# EAGLE design Addon-mapleCUx_Raspi-3V3-UART-CC2530-V007 (EAGLE 7.6.0)
MAPLE-CUx Large Version
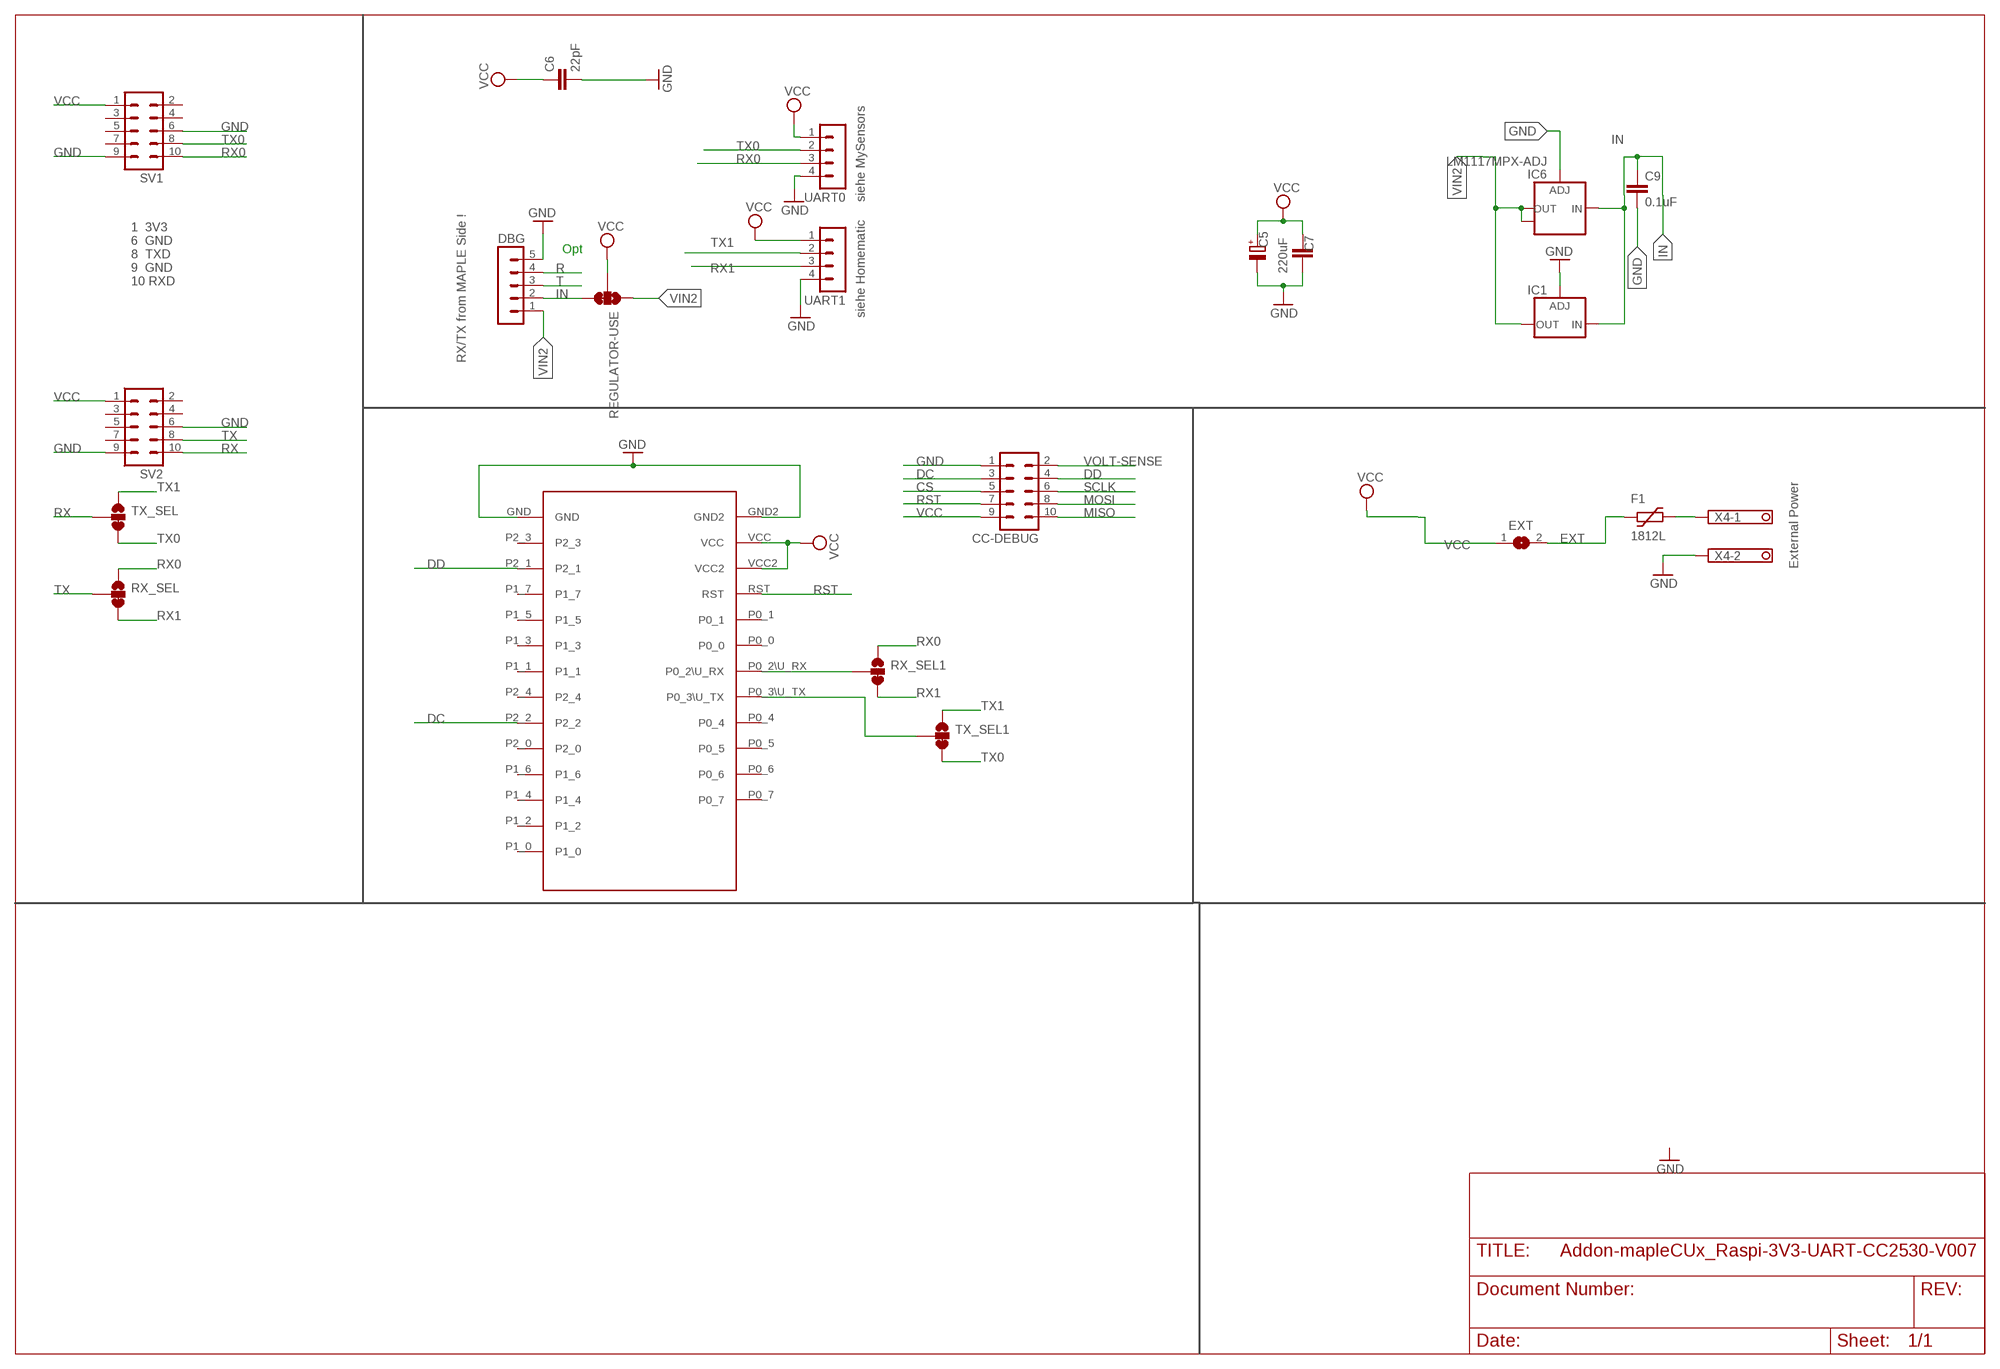
[diagram p0: schematic, sheet 1]

## Parts
C5  220uF  CPOL-EUE5-8.5  [E5-8,5]
C6  22pF  C-EUC0805  [C0805]
C7  C-EUC1812  [C1812]
C9  0.1uF  C-EUC1206  [C1206]
CC-DEBUG  MA05-2  [MA05-2]
DBG  MA05-1  [MA05-1]
EXT  SJ  [SJ]
F1  1812L  [1812L]
IC1  LD117ADT50TR  [DPACK]
IC6  LM1117MPX-ADJ  [SOT223]
REGULATOR-USE  JUMPER-SMT_3_1-NC_TRACE_SILK  [SMT-JUMPER_3_1-NC_TRACE_SILK]
RX_SEL  JUMPER-SMT_3_1-NC_TRACE_SILK  [SMT-JUMPER_3_1-NC_TRACE_SILK]
RX_SEL1  JUMPER-SMT_3_1-NC_TRACE_SILK  [SMT-JUMPER_3_1-NC_TRACE_SILK]
SV1  MA05-2  [MA05-2]
SV2  MA05-2  [MA05-2]
TX_SEL  JUMPER-SMT_3_1-NC_TRACE_SILK  [SMT-JUMPER_3_1-NC_TRACE_SILK]
TX_SEL1  JUMPER-SMT_3_1-NC_TRACE_SILK  [SMT-JUMPER_3_1-NC_TRACE_SILK]
U$3  CC2530_MODULE  [CC2530_DIL]
UART0  MA04-1  [MA04-1]
UART1  MA04-1  [MA04-1]
X4  1751248  [1751248]

## Nets
CS: CC-DEBUG.5
DC: CC-DEBUG.3 U$3.P2_2
DD: CC-DEBUG.4 U$3.P2_1
EXT [PWR]: EXT.2 F1.P$1
GND [PWR]: C5.- C6.2 C7.1 C9.2 CC-DEBUG.1 DBG.5 IC1.1(ADJ) IC6.1(ADJ) SV1.6 SV1.9 SV2.6 SV2.9 U$3.GND U$3.GND2 UART0.4 UART1.4 X4.2
IN [PWR]: C9.1 DBG.2 IC1.3(IN) IC6.3(IN) REGULATOR-USE.3
MISO: CC-DEBUG.10
MOSI: CC-DEBUG.8
N$2: RX_SEL1.2 U$3.P0_2\U_RX
N$3: TX_SEL1.2 U$3.P0_3\U_TX
N$45 [PWR]: F1.P$2 X4.1
R: DBG.4
RST: CC-DEBUG.7 U$3.RST
RX: SV2.10 TX_SEL.2
RX0: RX_SEL1.1 RX_SEL.1 SV1.10 UART0.3
RX1: RX_SEL1.3 RX_SEL.3 UART1.3
SCLK: CC-DEBUG.6
T: DBG.3
TX: RX_SEL.2 SV2.8
TX0: SV1.8 TX_SEL1.3 TX_SEL.3 UART0.2
TX1: TX_SEL1.1 TX_SEL.1 UART1.2
VCC [PWR]: C5.+ C6.1 C7.2 CC-DEBUG.9 EXT.1 REGULATOR-USE.2 SV1.1 SV2.1 U$3.VCC U$3.VCC2 UART0.1 UART1.1
VIN2 [PWR]: DBG.1 IC1.4(OUT) IC6.2(OUT) IC6.TAB(OUT1) REGULATOR-USE.1
VOLT-SENSE: CC-DEBUG.2
Unconnected: SV1.2 SV1.3 SV1.4 SV1.5 SV1.7 SV2.2 SV2.3 SV2.4 SV2.5 SV2.7 U$3.P0_0 U$3.P0_1 U$3.P0_4 U$3.P0_5 U$3.P0_6 U$3.P0_7 U$3.P1_0 U$3.P1_1 U$3.P1_2 U$3.P1_3 U$3.P1_4 U$3.P1_5 U$3.P1_6 U$3.P1_7 U$3.P2_0 U$3.P2_3 U$3.P2_4

## Notes on the sheet
- siehe MySensors
- Opt
- 1  3V3
  6  GND
  8  TXD
  9  GND
  10 RXD
- siehe Homematic
- RX/TX from MAPLE Side !
- External Power

## Library data of the parts
C5 = rcl:CPOL-EU: POLARIZED CAPACITOR, European symbol; SPICEPREFIX: C
C6 C7 C9 = rcl:C-EU: CAPACITOR, European symbol; SPICEPREFIX: C
CC-DEBUG SV1 SV2 = con-lstb:MA05-2: PIN HEADER; OC_FARNELL: unknown; OC_NEWARK: unknown
DBG = con-lstb:MA05-1: PIN HEADER; OC_FARNELL: unknown; OC_NEWARK: unknown
EXT = jumper:SJ: SMD solder JUMPER
F1 = ptc-littlefuse:1812L
IC1 = v-reg:LD117A?*: Low drop fixed and adjustable positive voltage regulators 1 A Source: http://www.st.com/stonline/products/literature/ds/7194/ld1117axx.pdf
IC6 = lm1117:LM1117MPX-ADJ
REGULATOR-USE RX_SEL RX_SEL1 TX_SEL TX_SEL1 = SparkFun-Jumpers:JUMPER-SMT_3_1-NC_TRACE: Normally closed trace jumper (1 of 2 connections) This jumper has a trace between two pads so it's normally closed (NC). The other connection is normally open (NO). Use a razor knife to open the connection. For best results follow the IPC guidelines for cutting traces: Cutout at least 0.063 mm (0.005 in). Remove all loose material to clean up the cut area. Seal the cut with an approved epoxy. Reapply solder to reclose the connection, or to close the NO connection.
U$3 = Martin-Communication-V3:CC2530_MODULE
UART0 UART1 = con-lstb:MA04-1: PIN HEADER; OC_FARNELL: unknown; OC_NEWARK: unknown
X4 = con-phoenix-350:1751248: MKDS 1/ 2-3,5 Printklemme Nennstrom: 10 A Bemessungsspannung: 160 V Raster: 3,5 mm Polzahl: 2 Montageart: Löten Anschlussart: Schraubanschluss Anschlussrichtung vom Leiter zur Platine: 0° Source: http://eshop.phoenixcontact.com .. 1751248.pdf; OC_FARNELL: unknown; OC_NEWARK: unknown

## Net classes
0 default: width 0.305 mm
1 PWR: width 0.914 mm

## Board
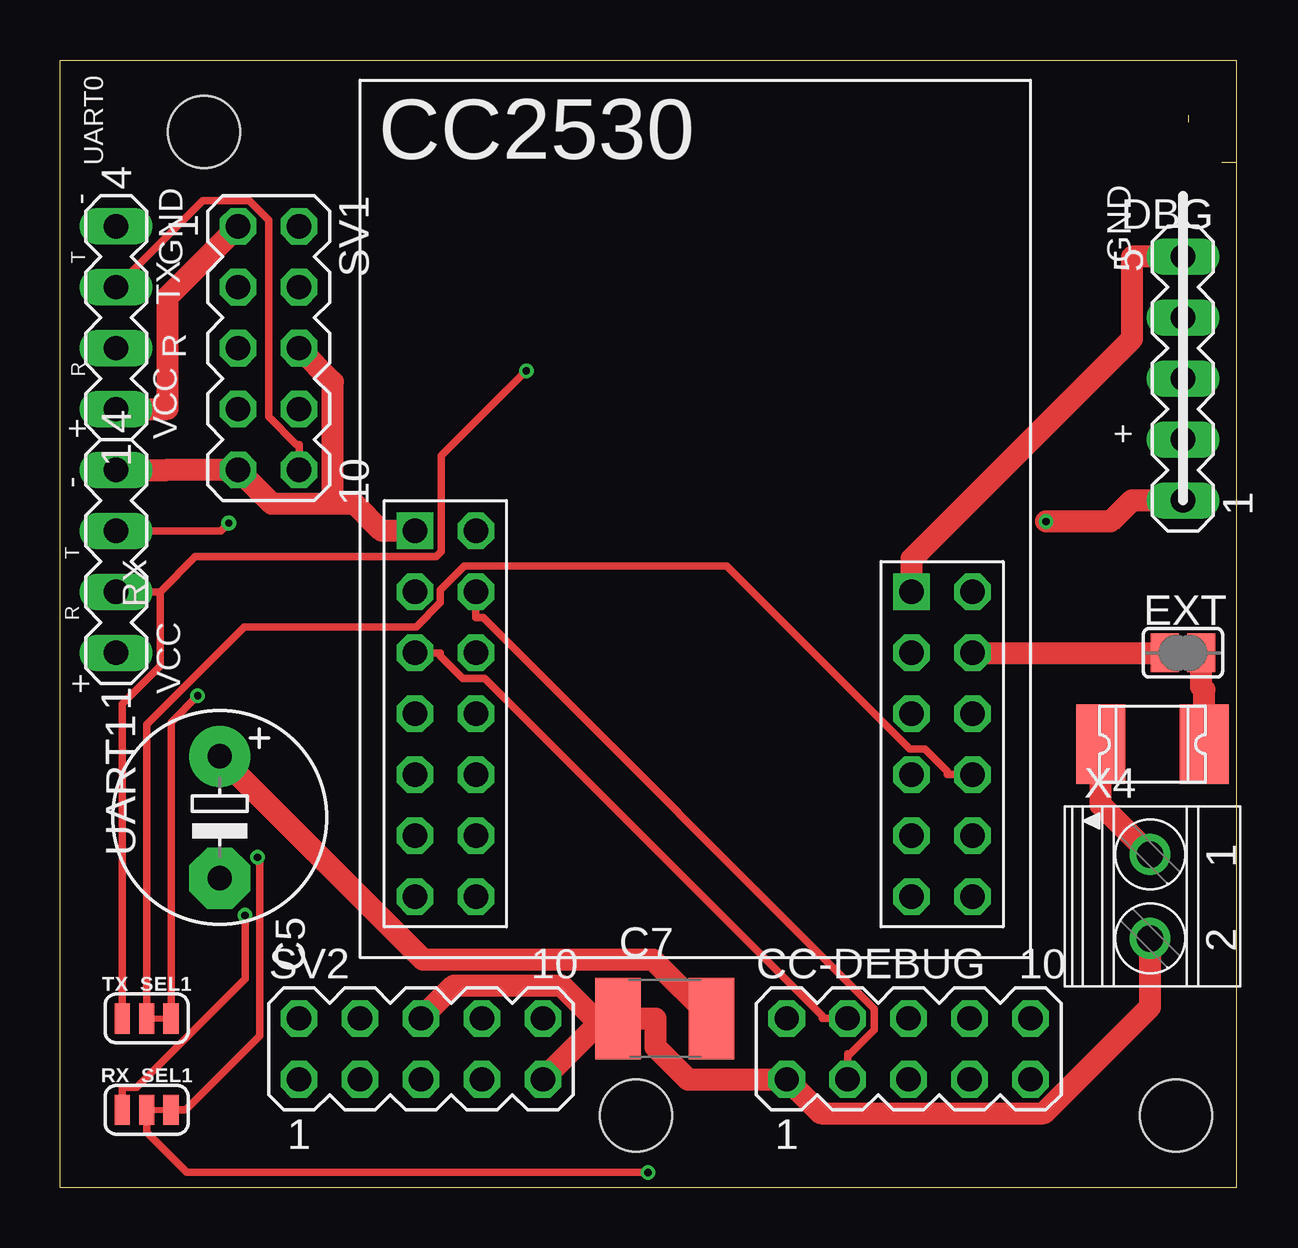
[diagram p1: board, top side]
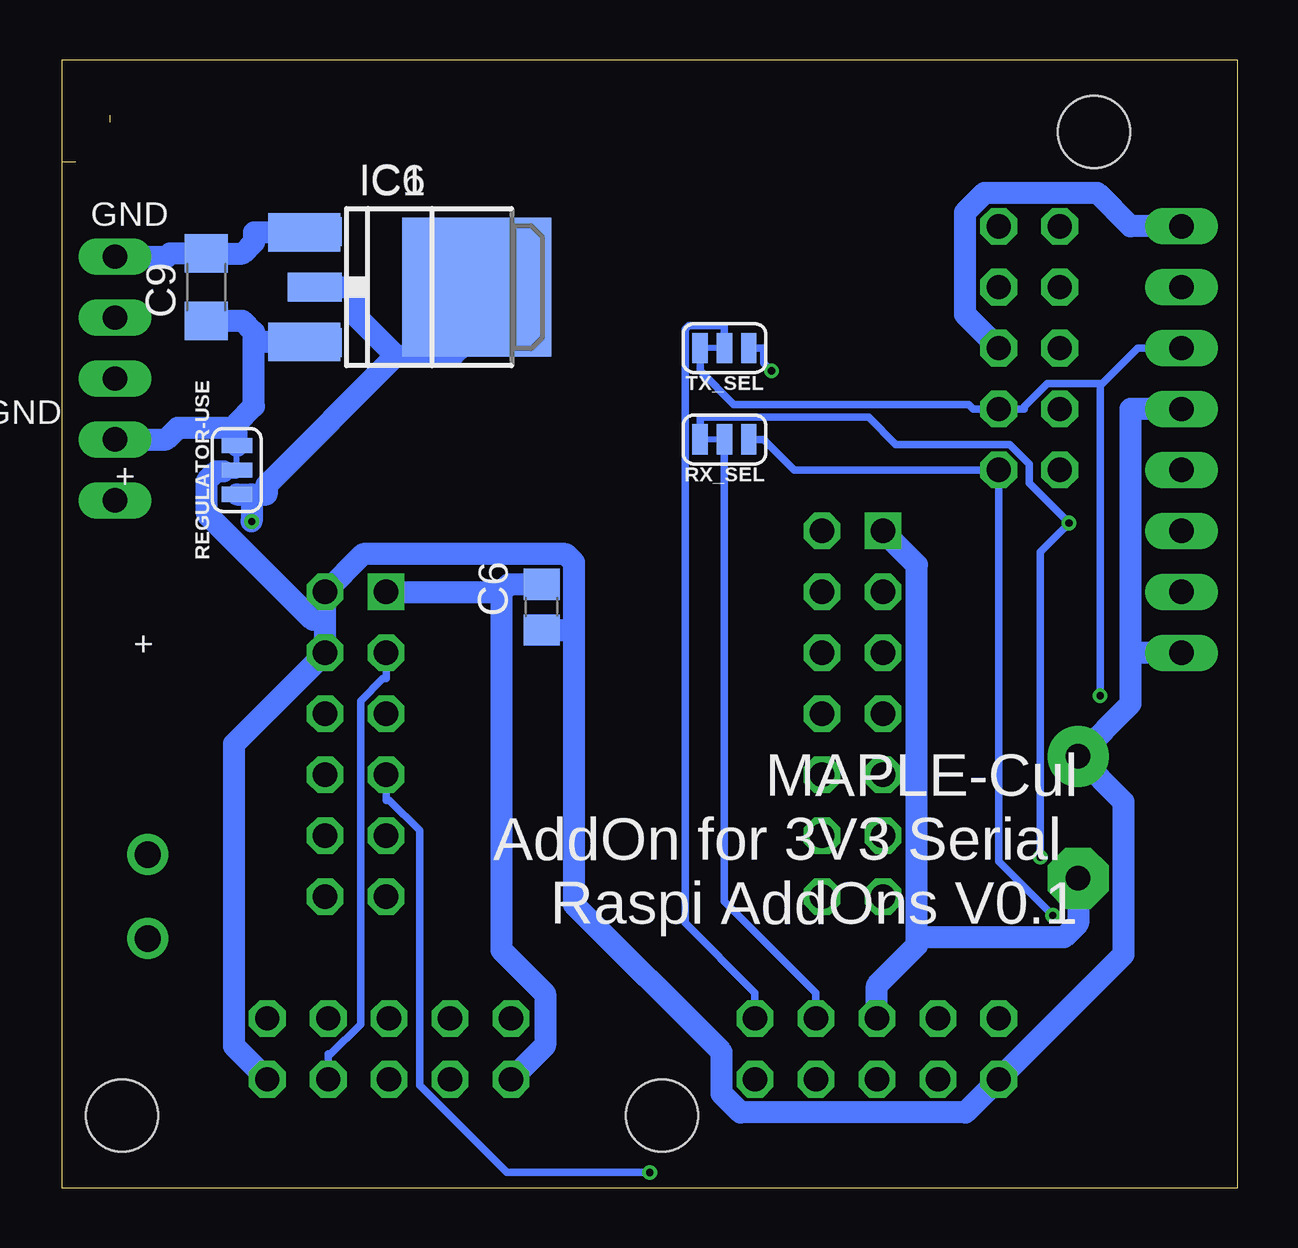
[diagram p2: board, bottom side, seen from below]

Size 49 x 47 mm. Coordinates in mm from the lower left corner, seen from the top.
Outline: 49,47 49,46.24
Outline: 47,44.7 47,44.41
Outline: 48.41,42.75 49,42.75
Outline: 49,47 0,47 0,0 49,0 49,42.75
Outline: 49,47 49,42.75
Copper layers (1*16): Top 0.035mm / dielectric 1.5mm / Bottom 0.035mm
Design rules "SeeedStudio_2layer_DRU_no_angle_20140221": minimum track width 6mil, minimum drill 12mil, track to track 6mil, track to pad 6mil, pad to pad 6mil, via to via 6mil, smd to smd 0mil, copper to edge 10mil, drill to drill 10mil, minimum pad ring 10mil, minimum via ring 6mil, stop-mask expansion 2mil, vias tented up to drill 100mil, thermal gap 10mil
Holes 3 mm at 6,44 24,3 46.5,3
tRestrict: area 0.4,2 to 1.1,47.1
bRestrict: area 0.4,0.7 to 1.1,46.4

### Footprints (pad centres in the part's own frame; a part is rotated, then mirrored left to right if it is on the bottom)
E5-8,5 = drill 1.016 pad 2.54: + -2.54,0 | drill 1.016 pad 2.54 octagon: - 2.54,0
C0805 = smd 1.3 x 1.5: 1 -0.95,0; 2 0.95,0
C1812 = smd 1.9 x 3.4: 1 -1.95,0; 2 1.95,0
C1206 = smd 1.6 x 1.8: 1 -1.4,0; 2 1.4,0
MA05-2 = drill 1.016 octagon: 1 -5.08,-1.27; 2 -5.08,1.27; 3 -2.54,-1.27; 4 -2.54,1.27; 5 0,-1.27; 6 0,1.27; 7 2.54,-1.27; 8 2.54,1.27; 9 5.08,-1.27; 10 5.08,1.27
MA05-1 = drill 1.016 long: 1 -5.08,0; 2 -2.54,0; 3 0,0; 4 2.54,0; 5 5.08,0
SJ = smd 1.168 x 1.6: 1 -0.762,0; 2 0.762,0
1812L = smd 2.03 x 3.3: P$1 -2.16,0; P$2 2.16,0
DPACK = smd 1.6 x 3: 1 -2.28,-4.8; 3 2.28,-4.8 | smd 5.8 x 6.2: 4 0,2.38
SOT223 = smd 1.219 x 2.235: 1 -2.311,-3.099; 2 0,-3.099; 3 2.311,-3.099 | smd 3.6 x 2.2: TAB 0,3.099
SMT-JUMPER_3_1-NC_TRACE_SILK = smd 0.635 x 1.27: 1 -1.016,0; 2 0,0; 3 1.016,0
CC2530_DIL = drill 1.016 square: GND -11.684,-1.27; GND2 9.017,-3.81 | drill 1.016 octagon: P0_0 9.017,-8.89; P0_1 11.557,-8.89; P0_2\U_RX 9.017,-11.43; P0_3\U_TX 11.557,-11.43; P0_4 9.017,-13.97; P0_5 11.557,-13.97; P0_6 9.017,-16.51; P0_7 11.557,-16.51; P1_0 -9.144,-16.51; P1_1 -11.684,-16.51; P1_2 -9.144,-13.97; P1_3 -11.684,-13.97; P1_4 -9.144,-11.43; P1_5 -11.684,-11.43; P1_6 -9.144,-8.89; P1_7 -11.684,-8.89; P2_0 -9.144,-6.35; P2_1 -11.684,-6.35; P2_2 -9.144,-3.81; P2_3 -11.684,-3.81; P2_4 -9.144,-1.27; RST 9.017,-6.35; VCC 11.557,-3.81; VCC2 11.557,-6.35
MA04-1 = drill 1.016 long: 1 -3.81,0; 2 -1.27,0; 3 1.27,0; 4 3.81,0
1751248 = drill 1.1 pad 1.7: 1 -1.75,-0.1; 2 1.75,-0.1

### Placement (x,y rotation side)
C5  6.66,15.43 270 top
C6  29.01,24.2 90 bottom
C7  25.2,7.05 0 top
C9  42.98,37.53 90 bottom
CC-DEBUG  35.36,5.78 0 top
DBG  46.79,33.72 90 top
EXT  46.79,22.29 0 top
F1  45.52,18.48 180 top
IC1  34.09,37.53 270 bottom
IC6  35.36,37.53 270 bottom
REGULATOR-USE  41.71,29.91 90 bottom
RX_SEL  21.39,31.18 180 bottom
RX_SEL1  3.61,3.24 0 top
SV1  8.69,34.99 270 top
SV2  15.04,5.78 0 top
TX_SEL  21.39,34.99 180 bottom
TX_SEL1  3.61,7.05 0 top
U$3  26.47,28.64 0 top
UART0  2.34,36.26 90 top
UART1  2.34,26.1 90 top
X4  45.52,12.13 270 top

### Tracks (layer width: path | path; a pad name or v marks a point on that pad's centre or on a via)
DC
  Top 0.305: CC-DEBUG.3 32.82,5.58 32.93,5.58 33.93,6.58 33.93,7.46 17.63,23.76 17.33,23.76 U$3.P2_2
DD
  Top 0.305: CC-DEBUG.4 31.75,7.05 31.75,7.16 17.69,21.22 16.79,21.22 15.85,22.16 15.85,22.29 U$3.P2_1
EXT
  Top 0.914: F1.P$1 47.68,20.74 47.55,20.87 EXT.2
GND
  Top 0.914: 22.27,7.05 22.27,6.66 SV2.9 | SV2.6 16.42,8.43 20.89,8.43 22.27,7.05 | 22.27,7.05 22.47,7.05 C7.1 24.81,7.05 24.81,5.86 26.16,4.51 CC-DEBUG.1 31.69,3.1 41,3.1 45.42,7.53 X4.2 | 11.37,28.49 11.37,33.58 SV1.6 | 11.37,28.49 12.29,28.49 13.41,27.37 U$3.GND | 11.37,28.49 8.84,28.49 SV1.9 4.47,29.91 UART1.4 | U$3.GND2 35.49,26.2 44.66,35.37 44.66,38.8 DBG.5
  Bottom 0.914: 13.37,10.43 13.37,25.96 U$3.GND | 13.37,10.43 13.37,10.09 15.04,8.42 SV2.6 | 13.37,10.43 7.24,10.43 6.66,11.01 C5.- | UART0.4 4.47,40.07 5.87,41.46 10.55,41.46 11.36,40.65 11.36,36.39 SV1.6 | 30.69,24.83 30.69,9.9 28.86,8.08 28.86,5.93 CC-DEBUG.1 | U$3.GND2 30.69,24.83 | 30.69,24.83 30.37,25.15 C6.2 | DBG.5 44.62,38.8 44.49,38.93 C9.2 41.47,38.93 41,39.4 41,39.81 IC1.1 38.86,39.84 IC6.1
IN
  Bottom 0.914: DBG.2 44.66,31.18 44.18,31.66 41.71,31.66 | 41.71,31.66 41.71,31.85 41,32.56 41,35.25 | REGULATOR-USE.3 41.71,31.66 | 41,35.25 IC1.3 38.86,35.22 IC6.3 | 41,35.25 41,35.66 41.47,36.13 C9.1
N$2  (via drill 0.3 pad 0.61)
  Top 0.305: RX_SEL1.2 3.61,2.3 5.28,0.63 v24.5,0.63
  Bottom 0.305: U$3.P0_2\U_RX 35.49,16.14 35.35,16.14 34.09,14.88 34.09,4.25 30.47,0.63 v24.5,0.63
N$3
  Top 0.305: U$3.P0_3\U_TX 36.96,17.21 36.96,17.34 36.03,18.28 35.41,18.28 27.78,25.91 16.85,25.91 15.85,24.91 15.85,24.38 14.85,23.37 7.69,23.37 3.61,19.29 TX_SEL1.2
N$45
  Top 0.914: X4.1 43.36,15.94 F1.P$2
RST
  Bottom 0.305: CC-DEBUG.7 37.9,5.58 37.79,5.58 36.55,6.81 36.55,20.29 35.62,21.22 35.49,21.22 U$3.RST
RX
  Bottom 0.305: SV2.10 20.12,8.12 23.03,11.03 23.03,35.78 22.88,35.93 21.39,35.93 TX_SEL.2
RX0  (via drill 0.3 pad 0.61)
  Top 0.305: RX_SEL1.1 2.59,4.18 3.2,4.18 7.71,8.69 v7.71,11.34 | SV1.10 9.96,30.98 9.85,30.98 8.69,32.14 8.69,40.33 7.88,41.14 5.95,41.14 UART0.3
  Bottom 0.305: v7.71,11.34 9.96,13.59 SV1.10 18.48,29.91 19.75,31.18 RX_SEL.1
RX1  (via drill 0.3 pad 0.61)
  Top 0.305: v8.23,13.76 8.32,13.67 8.32,6.32 5.25,3.24 RX_SEL1.3 | UART1.3 6.7,27.37 v7.03,27.7
  Bottom 0.305: v8.23,13.76 8.23,26.49 v7.03,27.7 8.69,29.36 8.69,30.17 9.5,30.98 14.24,30.98 15.39,32.12 22.41,32.12 RX_SEL.3
TX
  Bottom 0.305: SV2.8 17.58,8.12 21.39,11.93 RX_SEL.2
TX0  (via drill 0.3 pad 0.61)
  Top 0.305: v5.74,20.5 4.63,19.39 4.63,7.99 TX_SEL1.3
  Bottom 0.305: 5.74,33.52 v5.74,20.5 | 5.74,33.52 5.64,33.52 4.17,34.99 UART0.2 | 5.74,33.52 7.94,33.52 8.89,32.56 8.89,32.45 SV1.8 11.03,32.45 11.22,32.64 21,32.64 22.41,34.05 TX_SEL.3
TX1  (via drill 0.3 pad 0.61)
  Top 0.305: 4.17,24.83 5.64,26.3 15.68,26.3 15.89,26.52 15.89,30.51 v19.43,34.05 | 4.17,24.83 4.17,21.74 2.59,20.17 TX_SEL1.1 | UART1.2 4.17,24.83
  Bottom 0.305: TX_SEL.1 19.75,34.99 19.75,34.37 v19.43,34.05
VCC
  Top 0.914: C7.2 24.7,9.5 15.14,9.5 C5.+ | UART0.1 4.47,32.45 4.47,37.12 SV1.1 | U$3.VCC2 EXT.1
  Bottom 0.635: 42.25,29.86 41.76,29.86 REGULATOR-USE.2
  Bottom 0.914: UART0.1 4.47,32.45 4.47,22.29 | UART1.1 4.47,22.29 | 4.47,22.29 4.47,20.16 C5.+ 4.77,16.08 4.77,9.7 SV2.1 11.34,3.13 20.73,3.13 21.51,3.91 21.51,5.65 27.65,11.78 27.65,23.24 | 38.03,23.66 38.54,23.66 42.95,28.07 42.95,29.46 42.56,29.86 42.25,29.86 | 38.03,23.66 U$3.VCC 36.45,26.41 27.99,26.41 27.65,26.06 27.65,23.24 | 38.03,23.66 U$3.VCC2 41.82,18.5 41.82,5.89 CC-DEBUG.9 | C6.1 27.65,23.24
VIN2  (via drill 0.3 pad 0.61)
  Top 0.914: v41.09,27.76 43.78,27.76 44.66,28.64 DBG.1
  Bottom 0.914: 41.09,28.89 v41.09,27.76 | 41.09,28.89 40.47,28.89 40.47,29.29 35.08,34.67 | REGULATOR-USE.1 41.09,28.89 | IC6.2 36.73,37.53 36.73,36.32 35.08,34.67 | 35.08,34.67 32.71,34.67 32.26,35.12 IC6.TAB IC1.4

### Text on the board
tNames: GND | - | T | GND | TX | R | R | + | VCC | + | - | T | R | RX | VCC | +
bNames: GND | GND | + | + | MAPLE-Cul / AddOn for 3V3 Serial / Raspi AddOns V0.1